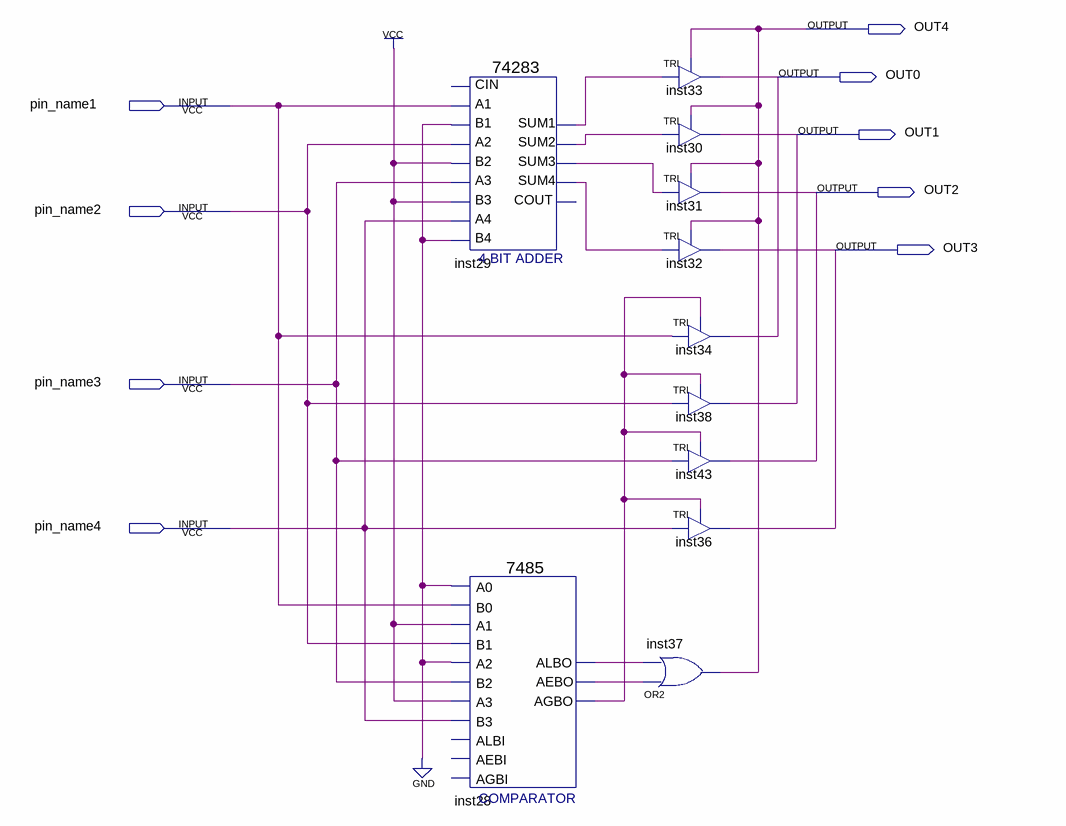
[diagram p0: schematic sheet]
// Quartus schematic displayfuck.bdf as structural Verilog: 11 symbols, 9 pins
module displayfuck (
  input  pin_name1,
  input  pin_name2,
  input  pin_name3,
  input  pin_name4,
  output OUT4,
  output OUT0,
  output OUT1,
  output OUT2,
  output OUT3
);

  wire inst28_aebo, inst28_agbo, inst28_albo, inst29_sum1, inst29_sum2, inst29_sum3, inst29_sum4;

  \74283  inst29 (
    .A1(pin_name1), .A2(pin_name2), .B2(1'b1), .A3(pin_name3), .A4(pin_name4), .B4(1'b0), .B1(1'b0),
    .B3(1'b1), .SUM4(inst29_sum4), .SUM1(inst29_sum1), .SUM2(inst29_sum2), .SUM3(inst29_sum3));  // open: CIN, COUT
  \7485  inst28 (
    .A3(1'b1), .B2(pin_name3), .A2(1'b0), .A0(1'b0), .B0(pin_name1), .B3(pin_name4), .A1(1'b1),
    .B1(pin_name2), .ALBO(inst28_albo), .AGBO(inst28_agbo), .AEBO(inst28_aebo));  // open: AEBI, AGBI, ALBI
  or inst37 (OUT4, inst28_aebo, inst28_albo);
  TRI inst33 (.IN(inst29_sum1), .OE(OUT4), .OUT(OUT0));
  TRI inst30 (.IN(inst29_sum2), .OE(OUT4), .OUT(OUT1));
  TRI inst31 (.IN(inst29_sum3), .OE(OUT4), .OUT(OUT2));
  TRI inst32 (.IN(inst29_sum4), .OE(OUT4), .OUT(OUT3));
  TRI inst34 (.IN(pin_name1), .OE(inst28_agbo), .OUT(OUT0));
  TRI inst38 (.IN(pin_name2), .OE(inst28_agbo), .OUT(OUT1));
  TRI inst43 (.IN(pin_name3), .OE(inst28_agbo), .OUT(OUT2));
  TRI inst36 (.IN(pin_name4), .OE(inst28_agbo), .OUT(OUT3));
endmodule
